# Altium schematic sheet Connectors.SchDoc
size A
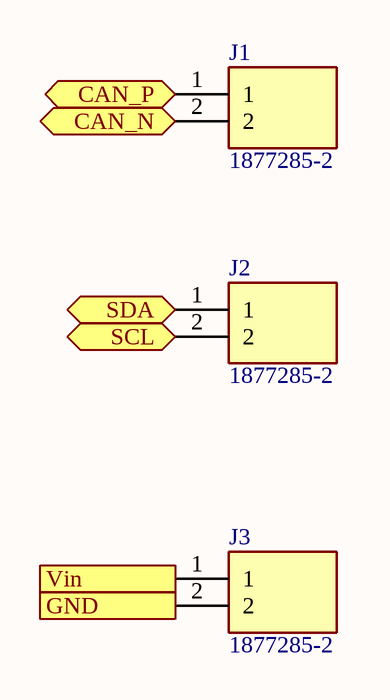
[diagram p0: Connectors.SchDoc]

## Parts
J1  1877285-2  [18772852]
J2  1877285-2  [18772852]
J3  1877285-2  [18772852]

## Ports
CAN_N (bidir), CAN_P (bidir), GND, SCL (bidir), SDA (bidir), Vin (out)

## Nets
CAN_N: J1.2 ; port CAN_N
CAN_P: J1.1 ; port CAN_P
GND: J3.2 ; port GND
SCL: J2.2 ; port SCL
SDA: J2.1 ; port SDA
Vin: J3.1 ; port Vin

## Library data of the parts
J1-J3 = 1877285-2: Connector; Manufacturer_Name: TE Connectivity; Datasheet Link: https://www.te.com/commerce/DocumentDelivery/DDEController?Action=srchrtrv&DocNm=7-1773458-5_ECONOMY_POWER_QRG&DocType=Data%20Sheet&DocLang=English&PartCntxt=1877285-2&DocFormat=pdf; Height: 12mm; Manufacturer_Part_Number: 1877285-2; Mouser Part Number: 571-1877285-2; Mouser Price/Stock: https://www.mouser.co.uk/ProductDetail/TE-Connectivity/1877285-2?qs=ka3zfMQDmFlAIZq5pDt5JA%3D%3D; Arrow Part Number: 1877285-2; Arrow Price/Stock: https://www.arrow.com/en/products/1877285-2/te-connectivity?region=europe